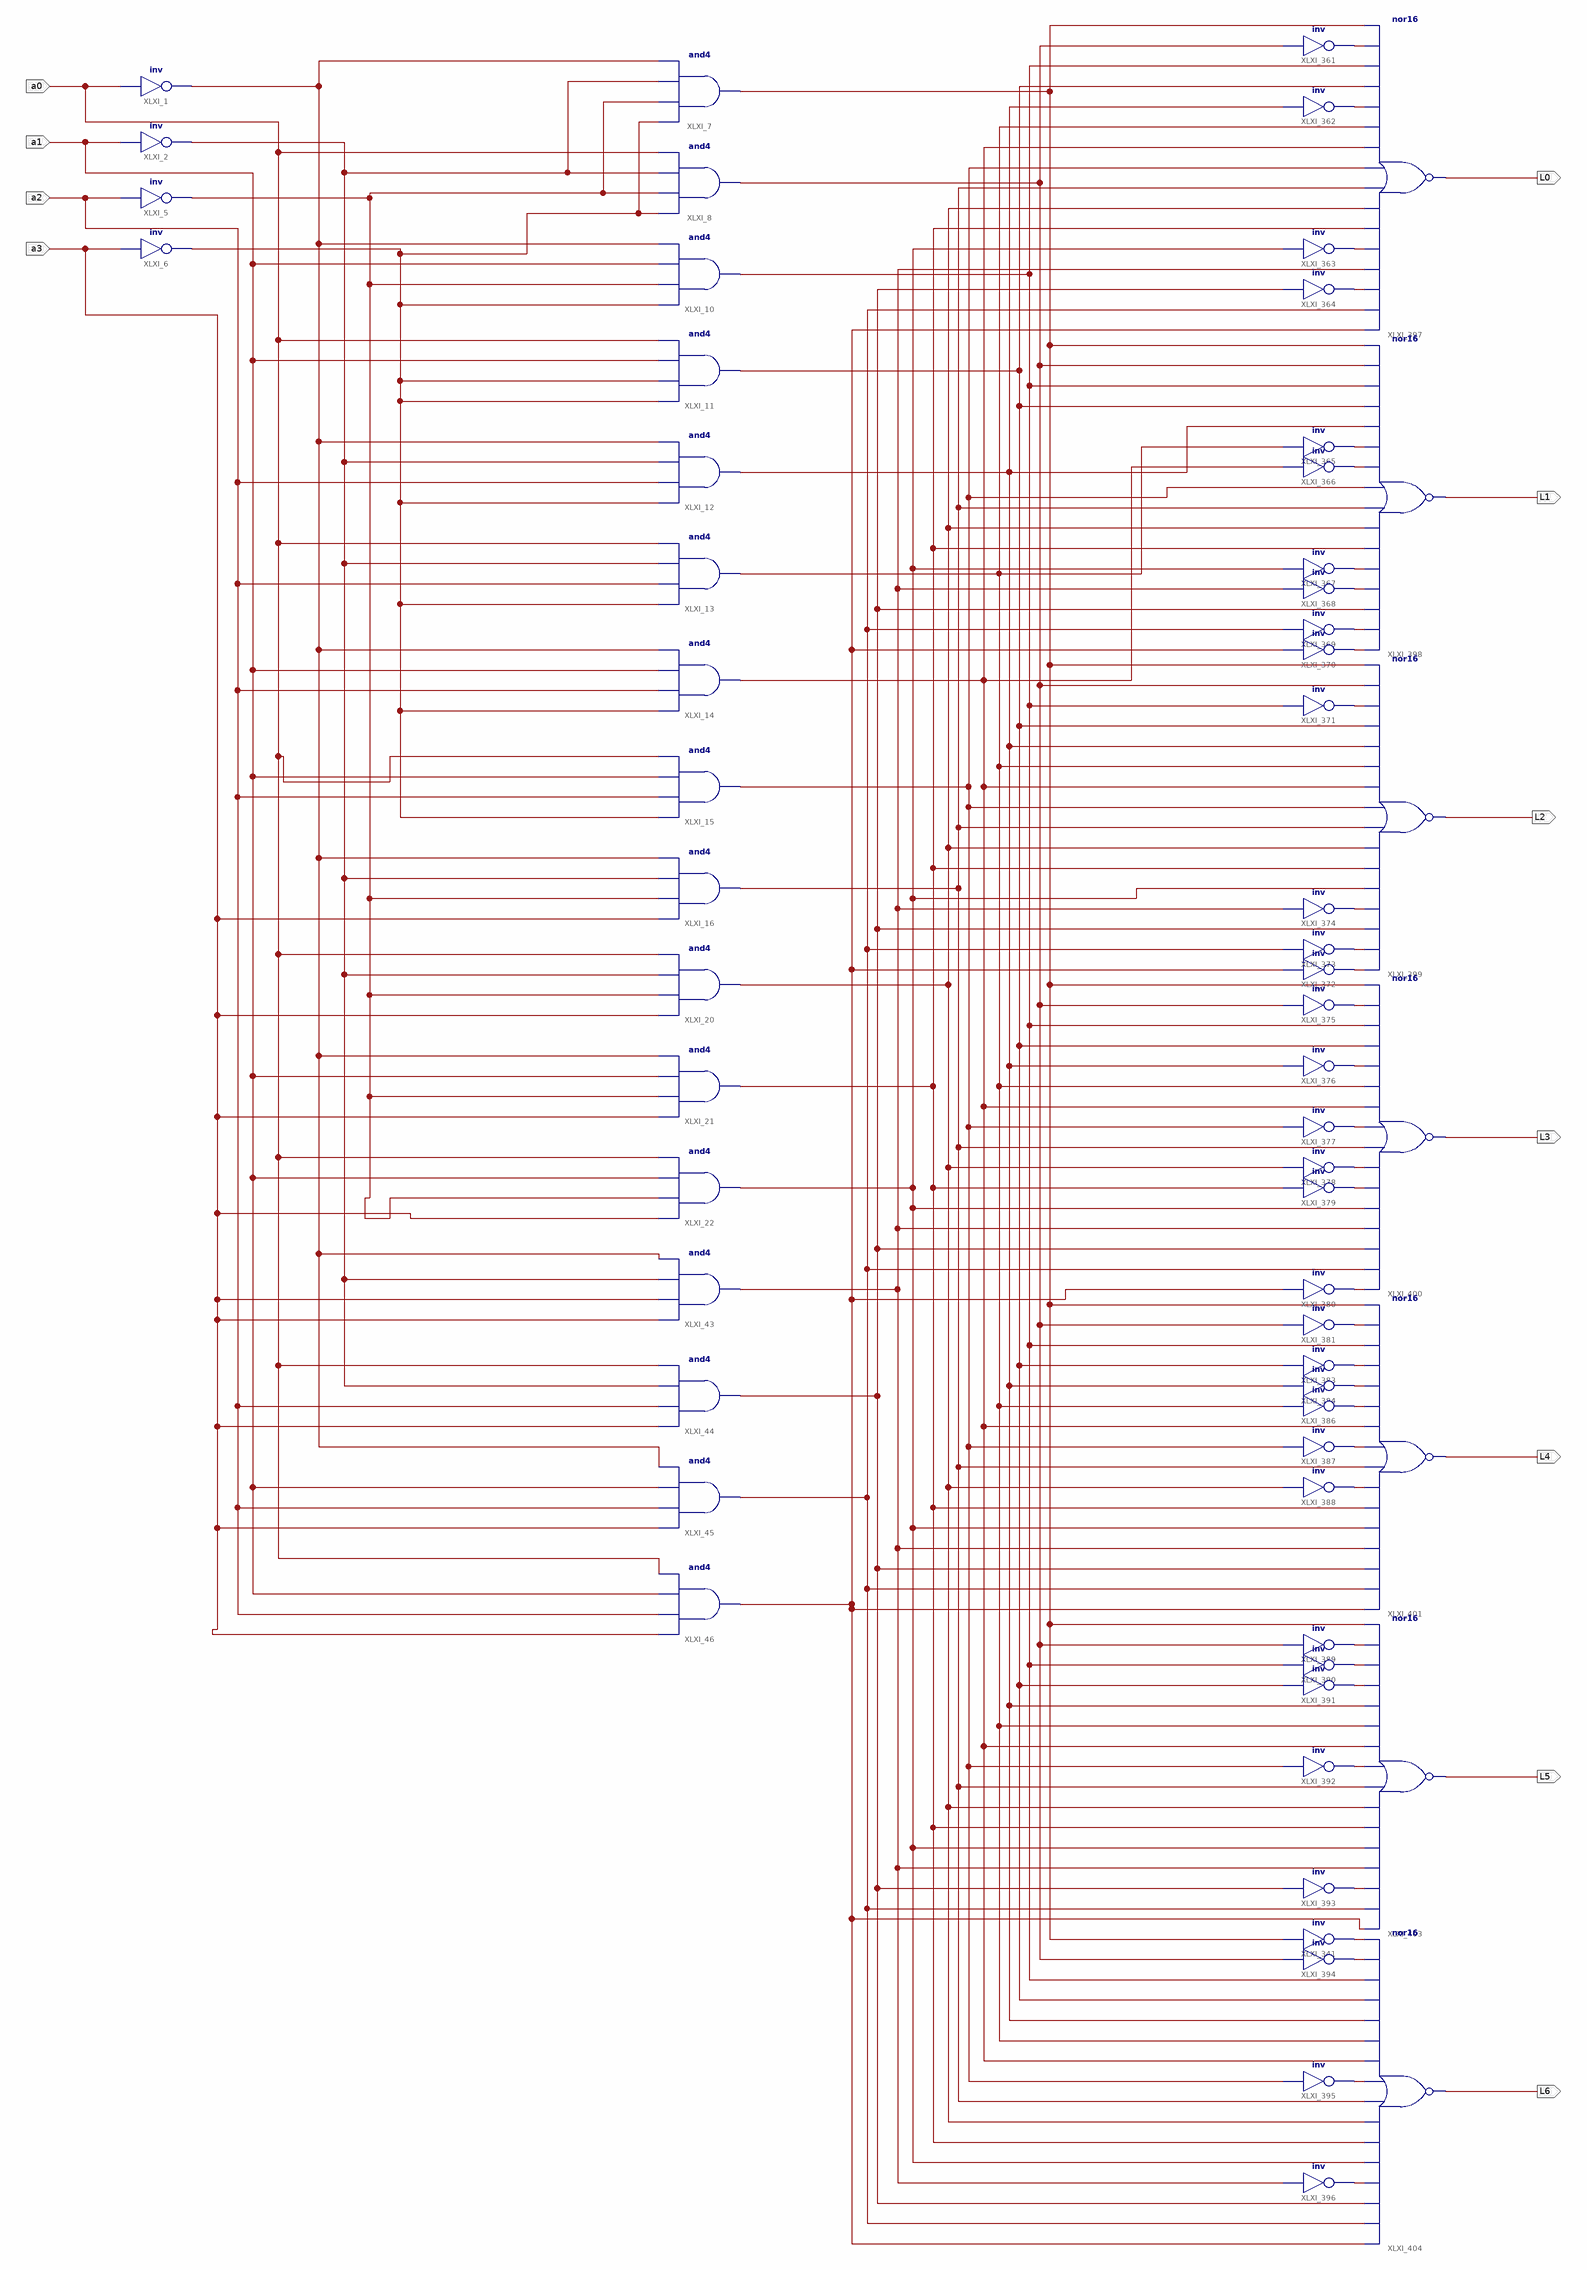
[diagram p0: schematic sheet 1]
// Xilinx ISE schematic bin_to_7seghex_sch.sch (spartan3e) as structural Verilog: 62 symbols, 11 ports
module bin_to_7seghex_sch (
  input  a1,
  input  a2,
  input  a3,
  input  a0,
  output L0,
  output L1,
  output L2,
  output L3,
  output L4,
  output L5,
  output L6
);

  wire XLXN_19, XLXN_20, XLXN_21, XLXN_22, XLXN_23, XLXN_24, XLXN_25, XLXN_26, XLXN_27, XLXN_28, XLXN_29,
       XLXN_30, XLXN_31, XLXN_32, XLXN_33, XLXN_34, XLXN_73, XLXN_74, XLXN_75, XLXN_76, XLXN_77, XLXN_78,
       XLXN_79, XLXN_80, XLXN_81, XLXN_82, XLXN_83, XLXN_84, XLXN_85, XLXN_86, XLXN_87, XLXN_88, XLXN_89,
       XLXN_90, XLXN_91, XLXN_92, XLXN_129, XLXN_138, XLXN_146, XLXN_155, XLXN_163, XLXN_177, XLXN_184,
       XLXN_191, XLXN_197, XLXN_199, XLXN_214, XLXN_220, XLXN_226, XLXN_232, XLXN_237, XLXN_289, XLXN_290,
       XLXN_291, XLXN_292;

  not XLXI_1 (XLXN_292, a0);
  not XLXI_2 (XLXN_291, a1);
  not XLXI_5 (XLXN_290, a2);
  not XLXI_6 (XLXN_289, a3);
  and XLXI_7 (XLXN_19, XLXN_289, XLXN_290, XLXN_291, XLXN_292);
  and XLXI_8 (XLXN_129, XLXN_289, XLXN_290, XLXN_291, a0);
  and XLXI_10 (XLXN_138, XLXN_289, XLXN_290, a1, XLXN_292);
  and XLXI_11 (XLXN_146, XLXN_289, XLXN_289, a1, a0);
  and XLXI_12 (XLXN_155, XLXN_289, a2, XLXN_291, XLXN_292);
  and XLXI_13 (XLXN_163, XLXN_289, a2, XLXN_291, a0);
  and XLXI_14 (XLXN_177, XLXN_289, a2, a1, XLXN_292);
  and XLXI_15 (XLXN_184, XLXN_289, a2, a1, a0);
  and XLXI_16 (XLXN_191, a3, XLXN_290, XLXN_291, XLXN_292);
  and XLXI_20 (XLXN_197, a3, XLXN_290, XLXN_291, a0);
  and XLXI_21 (XLXN_199, a3, XLXN_290, a1, XLXN_292);
  and XLXI_22 (XLXN_214, a3, XLXN_290, a1, a0);
  and XLXI_43 (XLXN_220, a3, a3, XLXN_291, XLXN_292);
  and XLXI_44 (XLXN_226, a3, a2, XLXN_291, a0);
  and XLXI_45 (XLXN_232, a3, a2, a1, XLXN_292);
  and XLXI_46 (XLXN_237, a3, a2, a1, a0);
  not XLXI_341 (XLXN_20, XLXN_19);
  not XLXI_361 (XLXN_21, XLXN_129);
  not XLXI_362 (XLXN_22, XLXN_155);
  not XLXI_363 (XLXN_23, XLXN_214);
  not XLXI_364 (XLXN_24, XLXN_226);
  not XLXI_365 (XLXN_25, XLXN_163);
  not XLXI_366 (XLXN_26, XLXN_177);
  not XLXI_367 (XLXN_27, XLXN_214);
  not XLXI_368 (XLXN_28, XLXN_220);
  not XLXI_369 (XLXN_29, XLXN_232);
  not XLXI_370 (XLXN_30, XLXN_237);
  not XLXI_371 (XLXN_31, XLXN_138);
  not XLXI_372 (XLXN_32, XLXN_237);
  not XLXI_373 (XLXN_33, XLXN_232);
  not XLXI_374 (XLXN_34, XLXN_220);
  not XLXI_375 (XLXN_73, XLXN_129);
  not XLXI_376 (XLXN_74, XLXN_155);
  not XLXI_377 (XLXN_75, XLXN_184);
  not XLXI_378 (XLXN_76, XLXN_197);
  not XLXI_379 (XLXN_77, XLXN_199);
  not XLXI_380 (XLXN_78, XLXN_237);
  not XLXI_381 (XLXN_79, XLXN_129);
  not XLXI_383 (XLXN_80, XLXN_146);
  not XLXI_384 (XLXN_81, XLXN_155);
  not XLXI_386 (XLXN_82, XLXN_163);
  not XLXI_387 (XLXN_83, XLXN_184);
  not XLXI_388 (XLXN_84, XLXN_197);
  not XLXI_389 (XLXN_85, XLXN_129);
  not XLXI_390 (XLXN_86, XLXN_138);
  not XLXI_391 (XLXN_87, XLXN_146);
  not XLXI_392 (XLXN_88, XLXN_184);
  not XLXI_393 (XLXN_89, XLXN_226);
  not XLXI_394 (XLXN_90, XLXN_129);
  not XLXI_395 (XLXN_91, XLXN_184);
  not XLXI_396 (XLXN_92, XLXN_220);
  nor XLXI_397 (L0, XLXN_237, XLXN_232, XLXN_24, XLXN_220, XLXN_23, XLXN_199, XLXN_197, XLXN_191, XLXN_184, XLXN_177, XLXN_163, XLXN_22, XLXN_146, XLXN_138, XLXN_21, XLXN_19);
  nor XLXI_398 (L1, XLXN_30, XLXN_29, XLXN_226, XLXN_28, XLXN_27, XLXN_199, XLXN_197, XLXN_191, XLXN_184, XLXN_26, XLXN_25, XLXN_155, XLXN_146, XLXN_138, XLXN_129, XLXN_19);
  nor XLXI_399 (L2, XLXN_32, XLXN_33, XLXN_226, XLXN_34, XLXN_214, XLXN_199, XLXN_197, XLXN_191, XLXN_184, XLXN_177, XLXN_163, XLXN_155, XLXN_146, XLXN_31, XLXN_129, XLXN_19);
  nor XLXI_400 (L3, XLXN_78, XLXN_232, XLXN_226, XLXN_220, XLXN_214, XLXN_77, XLXN_76, XLXN_191, XLXN_75, XLXN_177, XLXN_163, XLXN_74, XLXN_146, XLXN_138, XLXN_73, XLXN_19);
  nor XLXI_401 (L4, XLXN_237, XLXN_232, XLXN_226, XLXN_220, XLXN_214, XLXN_199, XLXN_84, XLXN_191, XLXN_83, XLXN_177, XLXN_82, XLXN_81, XLXN_80, XLXN_138, XLXN_79, XLXN_19);
  nor XLXI_403 (L5, XLXN_237, XLXN_232, XLXN_89, XLXN_220, XLXN_214, XLXN_199, XLXN_197, XLXN_191, XLXN_88, XLXN_177, XLXN_163, XLXN_155, XLXN_87, XLXN_86, XLXN_85, XLXN_19);
  nor XLXI_404 (L6, XLXN_237, XLXN_232, XLXN_226, XLXN_92, XLXN_214, XLXN_199, XLXN_197, XLXN_191, XLXN_91, XLXN_177, XLXN_163, XLXN_155, XLXN_146, XLXN_138, XLXN_90, XLXN_20);
endmodule
